# EAGLE design lcd (EAGLE 6.4)
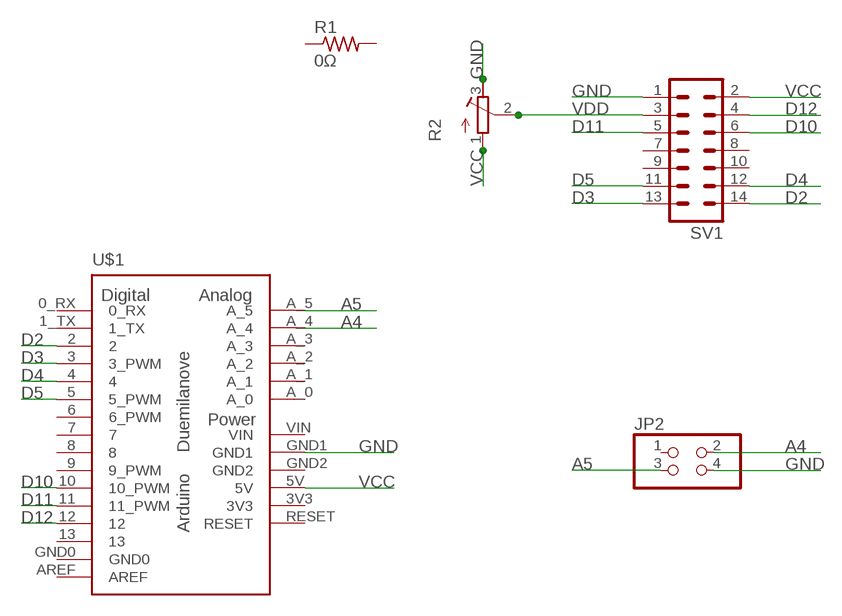
[diagram p0: schematic, sheet 1]

## Parts
JP2  PINHD-2X2  [2X02]
R1  0Ω  R-US_M1206  [M1206]
R2  R-TRIMM5W  [RTRIM5W]
SV1  MA07-2  [MA07-2]
U$1  ARDUINO-USBLONG_PADS_TEXT  [SHIELD]

## Nets
A4: JP2.2 U$1.A_4
A5: JP2.3 U$1.A_5
D2: SV1.14 U$1.2
D3: SV1.13 U$1.3(3_PWM)
D4: SV1.12 U$1.4
D5: SV1.11 U$1.5(5_PWM)
D10: SV1.6 U$1.10(10_PWM)
D11: SV1.5 U$1.11(11_PWM)
D12: SV1.4 U$1.12
GND: JP2.4 R2.3(E) SV1.1 U$1.GND1
VCC: R2.1(A) SV1.2 U$1.5V
VDD: R2.2(S) SV1.3
Unconnected: JP2.1 R1.1 R1.2 SV1.7 SV1.8 SV1.9 SV1.10 U$1.0_RX U$1.1_TX U$1.6(6_PWM) U$1.7 U$1.8 U$1.9(9_PWM) U$1.13 U$1.A_0 U$1.A_1 U$1.A_2 U$1.A_3 U$1.AREF U$1.GND0 U$1.GND2 U$1.RESET

## Power pins joined to a net without a drawn wire
3V3: U$1.3V3
VIN: U$1.VIN

## Library data of the parts
JP2 = pinhead:PINHD-2X2: PIN HEADER
R1 = 01_adafruit:R-US_: RESISTOR, American symbol
R2 = rcl:R-TRIMM: Trimm resistor
SV1 = con-lstb:MA07-2: PIN HEADER; OC_FARNELL: unknown; OC_NEWARK: unknown
U$1 = 01_Arduino-Various:ARDUINO-USB: The Ardiuno Duemilanove Pinouts layoutet as a Bare Shield. v0.5 Also for Arduino Diecimila. This is designed as a Part and has no Outline in the Dimension Layer. The Outline, when present, is drawed at the tPlace / bPlace Layer. Library by Stephanie Lange, http://www.k-ita.de/~sl/

## Board
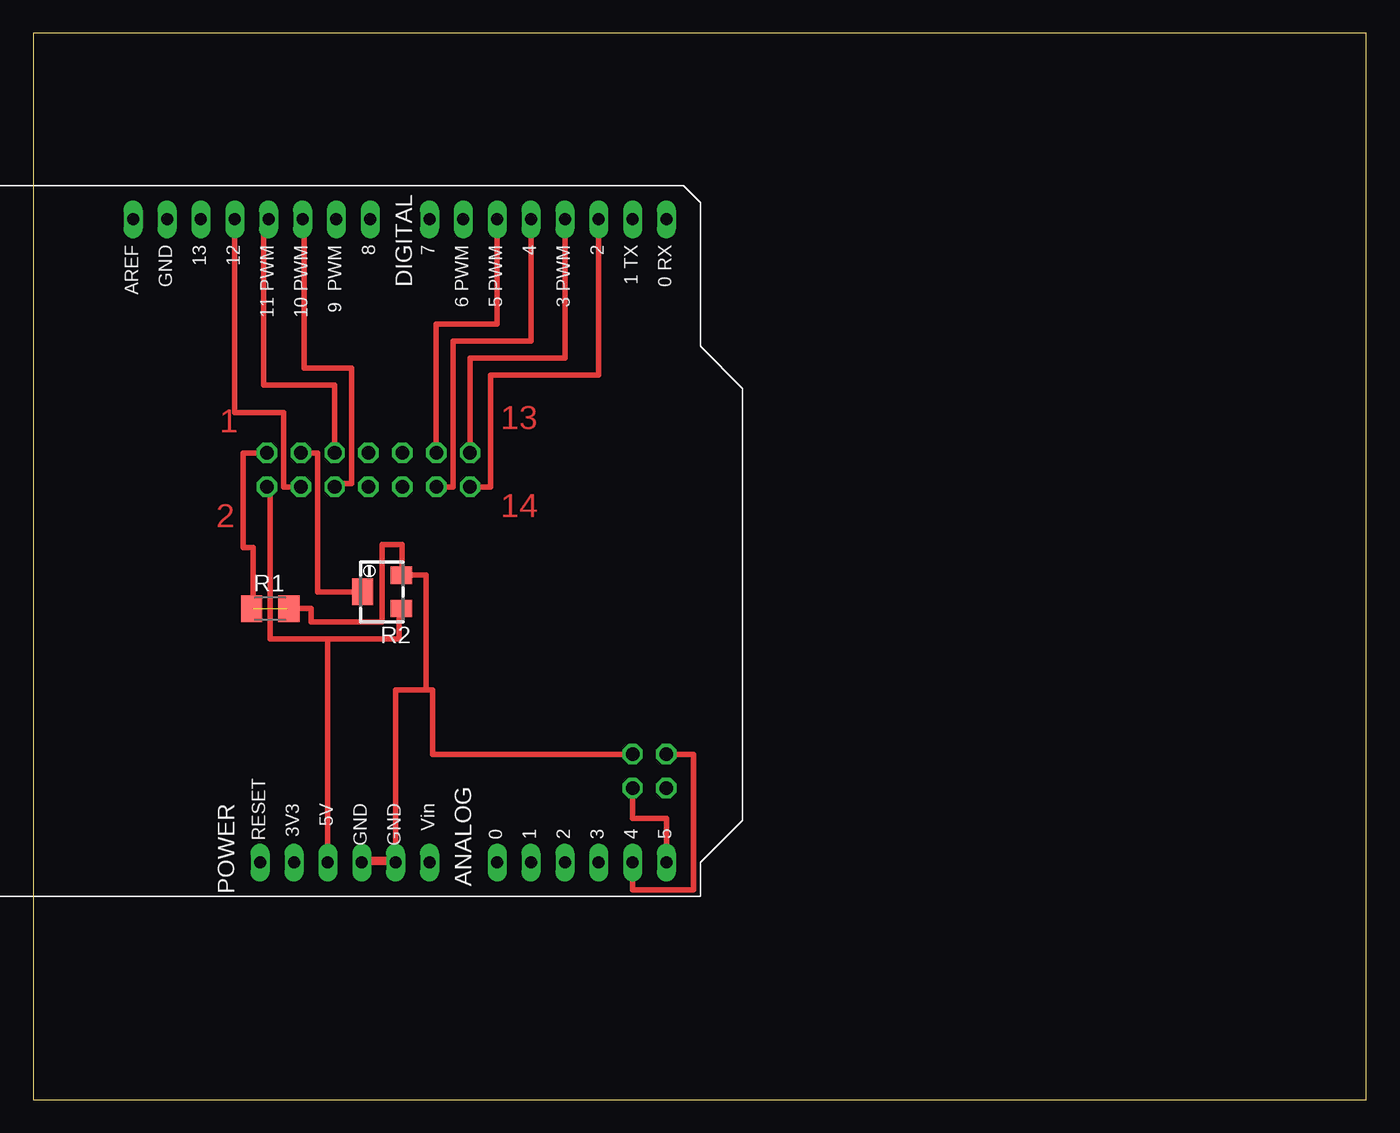
[diagram p1: board, top side]
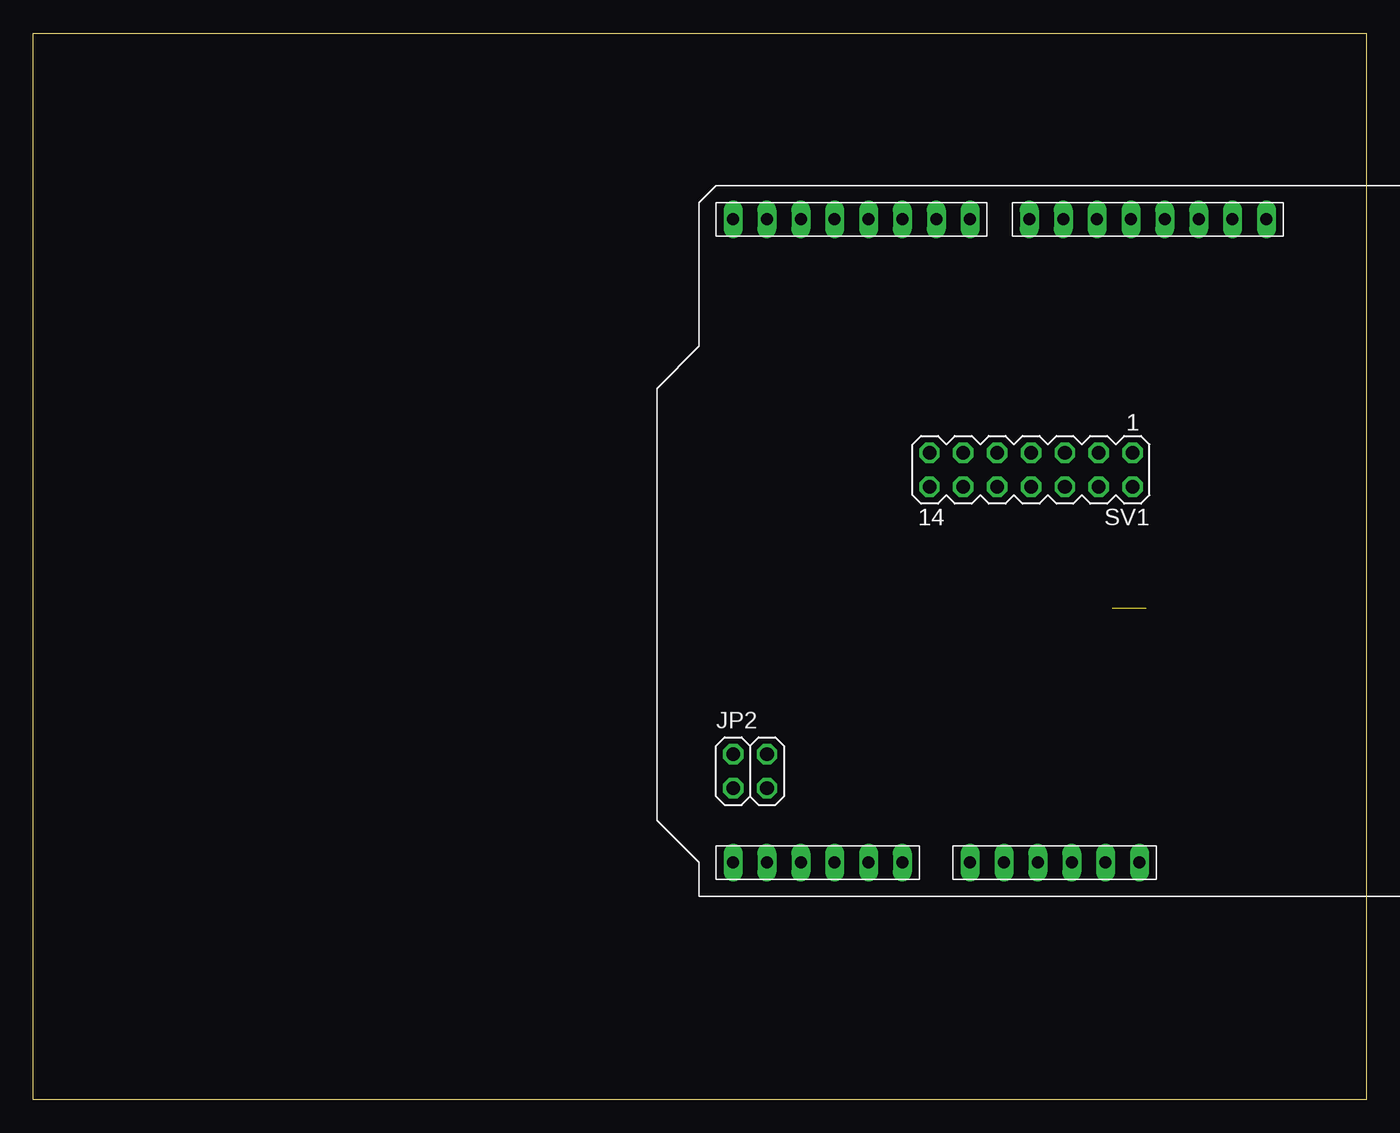
[diagram p2: board, bottom side, seen from below]

Size 100 x 80 mm. Coordinates in mm from the lower left corner, seen from the top.
Outline: 0,0 100,0 100,80 0,80 0,0
Copper layers (1*16): Top 0.035mm / dielectric 1.5mm / Bottom 0.035mm
Design rules "default": minimum track width 10mil, minimum drill 24mil, track to track 8mil, track to pad 8mil, pad to pad 8mil, via to via 8mil, smd to smd 8mil, copper to edge 40mil, drill to drill 8mil, minimum pad ring 10mil, minimum via ring 8mil, stop-mask expansion 4mil, vias tented up to drill 0mil, thermal gap 10mil

### Footprints (pad centres in the part's own frame; a part is rotated, then mirrored left to right if it is on the bottom)
2X02 = drill 1.016 octagon: 1 -1.27,-1.27; 2 -1.27,1.27; 3 1.27,-1.27; 4 1.27,1.27
M1206 = smd 1.6 x 2: 1 -1.4,0; 2 1.4,0
RTRIM5W = smd 1.3 x 1.6: 1 -1.25,-1.45; 3 1.25,-1.45 | smd 2 x 1.6: 2 0,1.45
MA07-2 = drill 1.016 octagon: 1 -7.62,-1.27; 2 -7.62,1.27; 3 -5.08,-1.27; 4 -5.08,1.27; 5 -2.54,-1.27; 6 -2.54,1.27; 7 0,-1.27; 8 0,1.27; 9 2.54,-1.27; 10 2.54,1.27; 11 5.08,-1.27; 12 5.08,1.27; 13 7.62,-1.27; 14 7.62,1.27
SHIELD = drill 0.9 pad 1.27 long: 0_RX -25.4,27.94; 1_TX -25.4,25.4; 2 -25.4,22.86; 3 -25.4,20.32; 3V3 22.86,0; 4 -25.4,17.78; 5 -25.4,15.24; 5V 22.86,2.54; 6 -25.4,12.7; 7 -25.4,10.16; 8 -25.4,5.715; 9 -25.4,3.175; 10 -25.4,0.635; 11 -25.4,-1.905; 12 -25.4,-4.445; 13 -25.4,-6.985; A_0 22.86,15.24; A_1 22.86,17.78; A_2 22.86,20.32; A_3 22.86,22.86; A_4 22.86,25.4; A_5 22.86,27.94; AREF -25.4,-12.065; GND0 -25.4,-9.525; GND1 22.86,7.62; GND2 22.86,5.08; RESET 22.86,-2.54; VIN 22.86,10.16

### Placement (x,y rotation side)
JP2  46.23,24.64 0 bottom
R1  17.78,36.83 0 top
R2  26.16,38.1 90 top
SV1  25.15,47.24 180 bottom
U$1  19.56,40.64 270 top

### Tracks (layer width: path | path; a pad name or v marks a point on that pad's centre or on a via)
A4
  Top 0.406: JP2.2 49.53,25.91 49.53,15.75 44.96,15.75 U$1.A_4
A5
  Top 0.406: JP2.3 44.96,21.08 47.5,21.08 U$1.A_5
D2
  Top 0.406: SV1.14 34.29,45.97 34.29,54.36 42.42,54.36 U$1.2
D3
  Top 0.406: U$1.3 39.88,55.63 32.77,55.63 SV1.13
D4
  Top 0.406: SV1.12 31.5,45.97 31.5,56.9 37.34,56.9 U$1.4
D5
  Top 0.406: U$1.5 34.8,58.17 30.23,58.17 SV1.11
D10
  Top 0.406: U$1.10 20.32,66.04 20.32,54.86 23.88,54.86 23.88,46.23 22.61,46.23 SV1.6
D11
  Top 0.406: U$1.11 17.27,66.04 17.27,53.59 22.61,53.59 SV1.5
D12
  Top 0.406: SV1.4 18.8,45.97 18.8,51.56 15.11,51.56 U$1.12
GND  (1 unrouted)
  Top 0.406: SV1.1 15.75,48.51 15.75,41.4 16.51,41.4 16.51,36.83 | 19.05,36.83 20.83,36.83 20.83,35.81 26.16,35.81 26.16,41.66 27.69,41.66 27.69,39.35 R2.3 29.46,39.35 29.46,30.73 | 29.46,30.73 27.18,30.73 U$1.GND1 | U$1.GND1 24.64,17.78 | 24.64,17.78 24.38,17.78 24.38,18.03 24.64,18.03 | 24.64,17.78 24.64,18.03 | 24.64,18.03 27.18,18.03 U$1.GND1 | 29.46,30.73 29.97,30.73 29.97,25.91 JP2.4
VCC
  Top 0.406: R2.1 27.43,36.85 27.43,34.54 22.1,34.54 | 22.1,34.54 U$1.5V | SV1.2 17.78,45.97 17.78,34.54 22.1,34.54
VDD
  Top 0.406: R2.2 21.34,38.1 21.34,48.51 SV1.3

### Text on the board
Top: 1 | 13 | 14 | 2